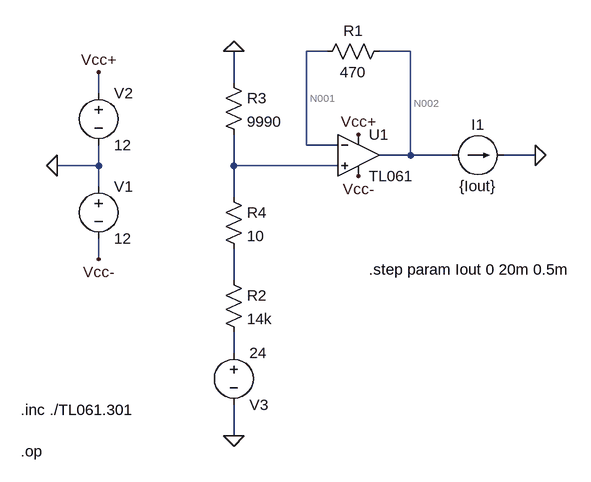
[diagram p0: schematic modul_10U_I.asc]
modul_10U_I.asc, the LTspice schematic file:
Version 4
SHEET 1 948 680
WIRE 528 -192 496 -192
WIRE 656 -192 608 -192
WIRE 384 -144 384 -192
WIRE 176 -128 176 -160
WIRE 496 -48 496 -192
WIRE 544 -48 496 -48
WIRE 656 -32 656 -192
WIRE 656 -32 608 -32
WIRE 720 -32 656 -32
WIRE 848 -32 800 -32
WIRE 176 -16 176 -48
WIRE 176 -16 112 -16
WIRE 384 -16 384 -64
WIRE 544 -16 384 -16
WIRE 176 16 176 -16
WIRE 384 32 384 -16
WIRE 176 128 176 96
WIRE 384 160 384 112
WIRE 384 272 384 240
WIRE 384 400 384 352
FLAG 112 -16 0
FLAG 176 -160 Vcc+
FLAG 176 128 Vcc-
FLAG 384 400 0
FLAG 576 -64 Vcc+
FLAG 576 0 Vcc-
FLAG 384 -192 0
FLAG 848 -32 0
SYMBOL voltage 176 0 R0
WINDOW 123 0 0 Left 0
WINDOW 39 0 0 Left 0
SYMATTR InstName V1
SYMATTR Value 12
SYMBOL voltage 176 -144 R0
WINDOW 123 0 0 Left 0
WINDOW 39 0 0 Left 0
SYMATTR InstName V2
SYMATTR Value 12
SYMBOL OpAmps\\opamp2 576 -96 R0
SYMATTR InstName U1
SYMATTR Value TL061
SYMBOL voltage 384 256 R0
WINDOW 0 24 96 Left 2
WINDOW 3 24 16 Left 2
WINDOW 123 0 0 Left 0
WINDOW 39 0 0 Left 0
SYMATTR InstName V3
SYMATTR Value 24
SYMBOL res 624 -208 R90
WINDOW 0 0 56 VBottom 2
WINDOW 3 32 56 VTop 2
SYMATTR InstName R1
SYMATTR Value 470
SYMBOL res 368 144 R0
SYMATTR InstName R2
SYMATTR Value 14k
SYMBOL res 368 -160 R0
SYMATTR InstName R3
SYMATTR Value 9990
SYMBOL res 368 16 R0
SYMATTR InstName R4
SYMATTR Value 10
SYMBOL current 720 -32 R270
WINDOW 0 32 40 VTop 2
WINDOW 3 -32 40 VBottom 2
WINDOW 123 0 0 Left 0
WINDOW 39 0 0 Left 0
SYMATTR InstName I1
SYMATTR Value {Iout}
TEXT 56 360 Left 2 !.inc ./TL061.301
TEXT 592 144 Left 2 !.step param Iout 0 20m 0.5m
TEXT 56 424 Left 2 !.op

The netlist it stands for:
* modul_10U_I.asc
V1 0 Vcc- 12
V2 Vcc+ 0 12
XU1 N003 N001 Vcc+ Vcc- N002 TL061  ; pins In+ In- V+ V- OUT
V3 N005 0 24
R1 N002 N001 470
R2 N004 N005 14k
R3 0 N003 9990
R4 N003 N004 10
I1 N002 0 {Iout}
.inc ./TL061.301
.step param Iout 0 20m 0.5m
.op
.backanno
.end

* Results of the author's LTspice run, read from the files saved beside the schematic
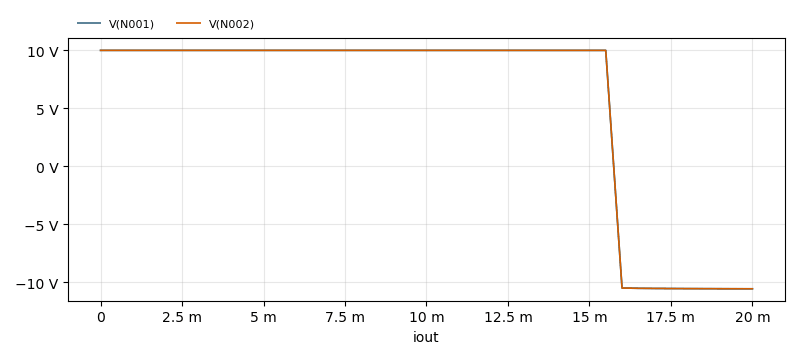
[diagram p1: Operating Point of modul_10U_I.asc, plotted from the saved traces]
* Operating Point, 1 run:
*   V(N001): 9.988 V at iout=0, -10.56 V at iout=20 m, min -10.56 V, max 9.988 V
*   V(N002): 9.988 V at iout=0, -10.56 V at iout=20 m, min -10.56 V, max 9.988 V
* From the log:
*   Semiconductor Device Operating Points:
*                           --- Diodes ---
*   Name:    d:u1:p      d:u1:ln     d:u1:lp     d:u1:e      d:u1:c
*   Model:    u1:dx       u1:dx       u1:dx       u1:dx       u1:dx
*   Id:     -2.40e-11   -1.50e-11   -1.50e-11   -1.98e-11    1.35e-12
*   Vd:     -2.40e+01   -1.50e+01   -1.50e+01   -1.98e+01    1.88e-01
*   Req:     1.00e+12    1.00e+12    1.00e+12    1.00e+12    2.18e+10
*   CAP:     0.00e+00    0.00e+00    0.00e+00    0.00e+00    0.00e+00
*                           --- JFET Transistors ---
*   Name:    j:u1:2      j:u1:1
*   Model:    u1:jx       u1:jx
*   Id:     -2.49e-05   -2.51e-05
*   Vgs:     5.02e-01    5.00e-01
*   Vds:    -2.12e+01   -2.12e+01
*   Gm:      1.00e-04    1.00e-04
*   Gds:     0.00e+00    0.00e+00
*   Cgs:     0.00e+00    0.00e+00
*   Cgd:     0.00e+00    0.00e+00